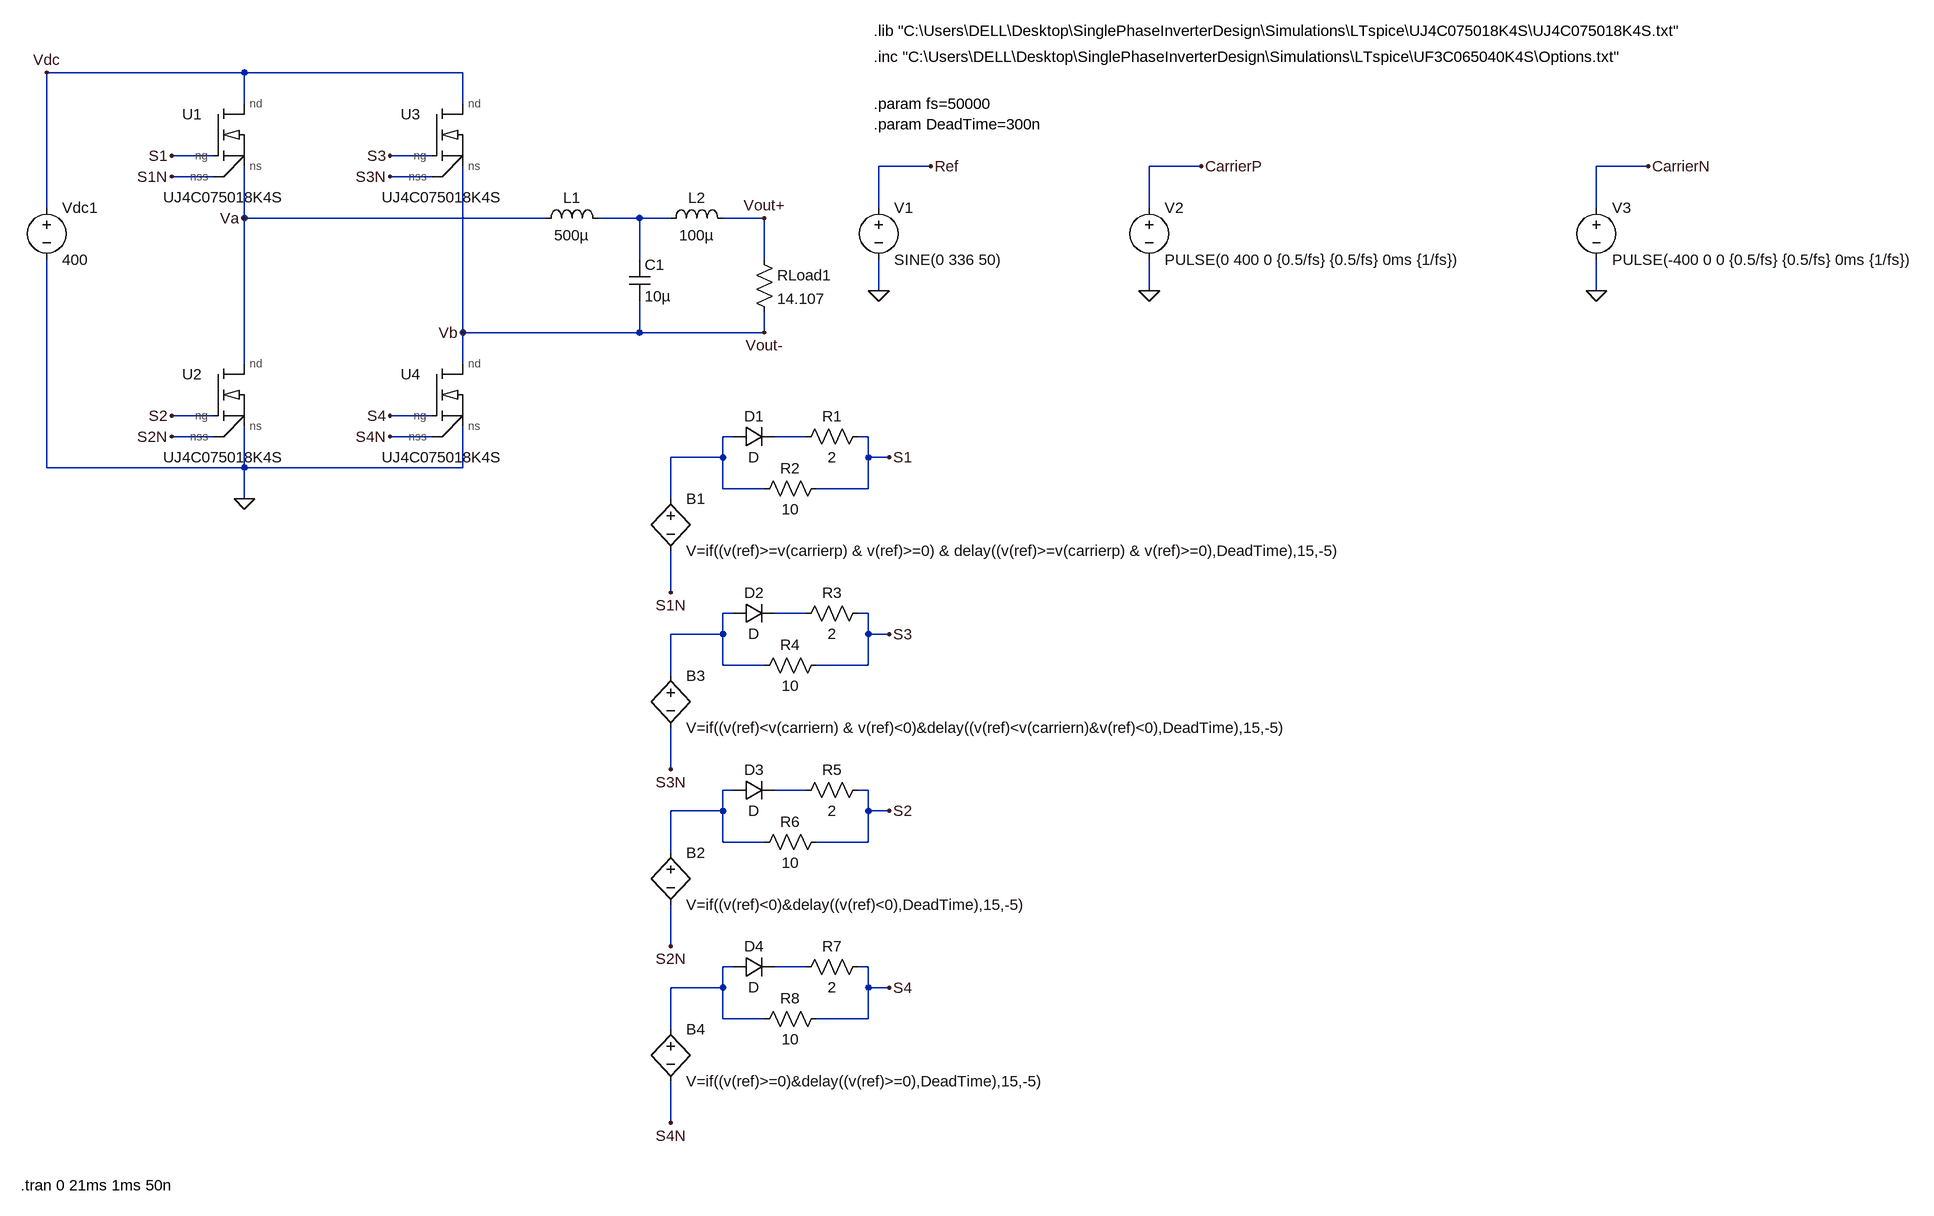
[diagram p0: schematic ModifiedUnipolar_UJ4C075018K4S_DeadTimeLow.asc]
ModifiedUnipolar_UJ4C075018K4S_DeadTimeLow.asc, the LTspice schematic file:
Version 4
SHEET 1 1584 1104
WIRE -992 -624 -1296 -624
WIRE -656 -624 -992 -624
WIRE -992 -576 -992 -624
WIRE -656 -576 -656 -624
WIRE -1040 -496 -1104 -496
WIRE -704 -496 -768 -496
WIRE 64 -480 -16 -480
WIRE 480 -480 400 -480
WIRE 1168 -480 1088 -480
WIRE -1040 -464 -1104 -464
WIRE -704 -464 -768 -464
WIRE -1296 -416 -1296 -624
WIRE -16 -416 -16 -480
WIRE 400 -416 400 -480
WIRE 1088 -416 1088 -480
WIRE -992 -400 -992 -480
WIRE -528 -400 -992 -400
WIRE -384 -400 -448 -400
WIRE -336 -400 -384 -400
WIRE -192 -400 -256 -400
WIRE -384 -336 -384 -400
WIRE -192 -336 -192 -400
WIRE -16 -288 -16 -336
WIRE 400 -288 400 -336
WIRE 1088 -288 1088 -336
WIRE -656 -224 -656 -480
WIRE -384 -224 -384 -272
WIRE -384 -224 -656 -224
WIRE -192 -224 -192 -256
WIRE -192 -224 -384 -224
WIRE -992 -176 -992 -400
WIRE -656 -176 -656 -224
WIRE -1040 -96 -1104 -96
WIRE -704 -96 -768 -96
WIRE -1040 -64 -1104 -64
WIRE -704 -64 -768 -64
WIRE -240 -64 -256 -64
WIRE -128 -64 -176 -64
WIRE -32 -64 -48 -64
WIRE -256 -32 -256 -64
WIRE -256 -32 -336 -32
WIRE -32 -32 -32 -64
WIRE 0 -32 -32 -32
WIRE -1296 -16 -1296 -336
WIRE -992 -16 -992 -80
WIRE -992 -16 -1296 -16
WIRE -656 -16 -656 -80
WIRE -656 -16 -992 -16
WIRE -256 16 -256 -32
WIRE -192 16 -256 16
WIRE -32 16 -32 -32
WIRE -32 16 -112 16
WIRE -992 32 -992 -16
WIRE -336 32 -336 -32
WIRE -336 176 -336 112
WIRE -240 208 -256 208
WIRE -128 208 -176 208
WIRE -32 208 -48 208
WIRE -256 240 -256 208
WIRE -256 240 -336 240
WIRE -32 240 -32 208
WIRE 0 240 -32 240
WIRE -256 288 -256 240
WIRE -192 288 -256 288
WIRE -32 288 -32 240
WIRE -32 288 -112 288
WIRE -336 304 -336 240
WIRE -336 448 -336 384
WIRE -240 480 -256 480
WIRE -128 480 -176 480
WIRE -32 480 -48 480
WIRE -256 512 -256 480
WIRE -256 512 -336 512
WIRE -32 512 -32 480
WIRE 0 512 -32 512
WIRE -256 560 -256 512
WIRE -192 560 -256 560
WIRE -32 560 -32 512
WIRE -32 560 -112 560
WIRE -336 576 -336 512
WIRE -336 720 -336 656
WIRE -240 752 -256 752
WIRE -128 752 -176 752
WIRE -32 752 -48 752
WIRE -256 784 -256 752
WIRE -256 784 -336 784
WIRE -32 784 -32 752
WIRE 0 784 -32 784
WIRE -256 832 -256 784
WIRE -192 832 -256 832
WIRE -32 832 -32 784
WIRE -32 832 -112 832
WIRE -336 848 -336 784
WIRE -336 992 -336 928
FLAG -16 -288 0
FLAG 64 -480 Ref
FLAG 400 -288 0
FLAG 480 -480 CarrierP
FLAG -992 32 0
FLAG -192 -400 Vout+
FLAG 1088 -288 0
FLAG 1168 -480 CarrierN
FLAG -192 -224 Vout-
FLAG 0 -32 S1
FLAG 0 240 S3
FLAG 0 512 S2
FLAG 0 784 S4
FLAG -336 176 S1N
FLAG -336 448 S3N
FLAG -336 720 S2N
FLAG -336 992 S4N
FLAG -1104 -496 S1
FLAG -1104 -96 S2
FLAG -1104 -464 S1N
FLAG -1104 -64 S2N
FLAG -768 -496 S3
FLAG -768 -464 S3N
FLAG -768 -96 S4
FLAG -768 -64 S4N
FLAG -1296 -624 Vdc
FLAG -992 -400 Va
FLAG -656 -224 Vb
SYMBOL voltage -16 -432 R0
WINDOW 123 0 0 Left 0
WINDOW 39 0 0 Left 0
SYMATTR InstName V1
SYMATTR Value SINE(0 336 50)
SYMBOL voltage 400 -432 R0
WINDOW 123 0 0 Left 0
WINDOW 39 0 0 Left 0
SYMATTR InstName V2
SYMATTR Value PULSE(0 400 0 {0.5/fs} {0.5/fs} 0ms {1/fs})
SYMBOL bv -336 16 R0
SYMATTR InstName B1
SYMATTR Value V=if((v(ref)>=v(carrierp) & v(ref)>=0) & delay((v(ref)>=v(carrierp) & v(ref)>=0),DeadTime),15,-5)
SYMBOL bv -336 560 R0
SYMATTR InstName B2
SYMATTR Value V=if((v(ref)<0)&delay((v(ref)<0),DeadTime),15,-5)
SYMBOL ind -544 -384 R270
WINDOW 0 32 56 VTop 2
WINDOW 3 5 56 VBottom 2
SYMATTR InstName L1
SYMATTR Value 500µ
SYMATTR SpiceLine Rser=30m
SYMBOL res -208 -352 R0
SYMATTR InstName RLoad1
SYMATTR Value 14.107
SYMBOL voltage -1296 -432 R0
WINDOW 123 0 0 Left 0
WINDOW 39 0 0 Left 0
SYMATTR InstName Vdc1
SYMATTR Value 400
SYMBOL cap -400 -336 R0
SYMATTR InstName C1
SYMATTR Value 10µ
SYMATTR SpiceLine Rser=0.1m
SYMBOL bv -336 288 R0
SYMATTR InstName B3
SYMATTR Value V=if((v(ref)<v(carriern) & v(ref)<0)&delay((v(ref)<v(carriern)&v(ref)<0),DeadTime),15,-5)
SYMBOL bv -336 832 R0
SYMATTR InstName B4
SYMATTR Value V=if((v(ref)>=0)&delay((v(ref)>=0),DeadTime),15,-5)
SYMBOL voltage 1088 -432 R0
WINDOW 123 0 0 Left 0
WINDOW 39 0 0 Left 0
SYMATTR InstName V3
SYMATTR Value PULSE(-400 0 0 {0.5/fs} {0.5/fs} 0ms {1/fs})
SYMBOL res -32 -80 R90
WINDOW 0 0 56 VBottom 2
WINDOW 3 32 56 VTop 2
SYMATTR InstName R1
SYMATTR Value 2
SYMBOL diode -240 -48 R270
WINDOW 0 32 32 VTop 2
WINDOW 3 0 32 VBottom 2
SYMATTR InstName D1
SYMBOL res -96 0 R90
WINDOW 0 0 56 VBottom 2
WINDOW 3 32 56 VTop 2
SYMATTR InstName R2
SYMATTR Value 10
SYMBOL res -32 192 R90
WINDOW 0 0 56 VBottom 2
WINDOW 3 32 56 VTop 2
SYMATTR InstName R3
SYMATTR Value 2
SYMBOL diode -240 224 R270
WINDOW 0 32 32 VTop 2
WINDOW 3 0 32 VBottom 2
SYMATTR InstName D2
SYMBOL res -96 272 R90
WINDOW 0 0 56 VBottom 2
WINDOW 3 32 56 VTop 2
SYMATTR InstName R4
SYMATTR Value 10
SYMBOL res -32 464 R90
WINDOW 0 0 56 VBottom 2
WINDOW 3 32 56 VTop 2
SYMATTR InstName R5
SYMATTR Value 2
SYMBOL diode -240 496 R270
WINDOW 0 32 32 VTop 2
WINDOW 3 0 32 VBottom 2
SYMATTR InstName D3
SYMBOL res -96 544 R90
WINDOW 0 0 56 VBottom 2
WINDOW 3 32 56 VTop 2
SYMATTR InstName R6
SYMATTR Value 10
SYMBOL res -32 736 R90
WINDOW 0 0 56 VBottom 2
WINDOW 3 32 56 VTop 2
SYMATTR InstName R7
SYMATTR Value 2
SYMBOL diode -240 768 R270
WINDOW 0 32 32 VTop 2
WINDOW 3 0 32 VBottom 2
SYMATTR InstName D4
SYMBOL res -96 816 R90
WINDOW 0 0 56 VBottom 2
WINDOW 3 32 56 VTop 2
SYMATTR InstName R8
SYMATTR Value 10
SYMBOL UF3C065040K4S -1024 -528 R0
SYMATTR InstName U1
SYMATTR Value UJ4C075018K4S
SYMBOL UF3C065040K4S -1024 -128 R0
SYMATTR InstName U2
SYMATTR Value UJ4C075018K4S
SYMBOL UF3C065040K4S -688 -528 R0
SYMATTR InstName U3
SYMATTR Value UJ4C075018K4S
SYMBOL UF3C065040K4S -688 -128 R0
SYMATTR InstName U4
SYMATTR Value UJ4C075018K4S
SYMBOL ind -352 -384 R270
WINDOW 0 32 56 VTop 2
WINDOW 3 5 56 VBottom 2
SYMATTR InstName L2
SYMATTR Value 100µ
TEXT -24 -648 Left 2 !.inc "C:\\Users\\DELL\\Desktop\\SinglePhaseInverterDesign\\Simulations\\LTspice\\UF3C065040K4S\\Options.txt"
TEXT -24 -688 Left 2 !.lib "C:\\Users\\DELL\\Desktop\\SinglePhaseInverterDesign\\Simulations\\LTspice\\UJ4C075018K4S\\UJ4C075018K4S.txt"
TEXT -1336 1088 Left 2 !.tran 0 21ms 1ms 50n
TEXT -24 -576 Left 2 !.param fs=50000\n.param DeadTime=300n

The netlist it stands for:
* ModifiedUnipolar_UJ4C075018K4S_DeadTimeLow.asc
V1 Ref 0 SINE(0 336 50)
V2 CarrierP 0 PULSE(0 400 0 {0.5/fs} {0.5/fs} 0ms {1/fs})
B1 N002 S1N V=if((v(ref)>=v(carrierp) & v(ref)>=0) & delay((v(ref)>=v(carrierp) & v(ref)>=0),DeadTime),15,-5)
B2 N006 S2N V=if((v(ref)<0)&delay((v(ref)<0),DeadTime),15,-5)
L1 Va N001 500µ Rser=30m
RLoad1 Vout+ Vb 14.107
Vdc1 Vdc 0 400
C1 N001 Vb 10µ Rser=0.1m
B3 N004 S3N V=if((v(ref)<v(carriern) & v(ref)<0)&delay((v(ref)<v(carriern)&v(ref)<0),DeadTime),15,-5)
B4 N008 S4N V=if((v(ref)>=0)&delay((v(ref)>=0),DeadTime),15,-5)
V3 CarrierN 0 PULSE(-400 0 0 {0.5/fs} {0.5/fs} 0ms {1/fs})
R1 S1 N003 2
D1 N002 N003 D
R2 S1 N002 10
R3 S3 N005 2
D2 N004 N005 D
R4 S3 N004 10
R5 S2 N007 2
D3 N006 N007 D
R6 S2 N006 10
R7 S4 N009 2
D4 N008 N009 D
R8 S4 N008 10
XU1 Vdc S1 Va S1N UJ4C075018K4S  ; pins nd ng ns nss
XU2 Va S2 0 S2N UJ4C075018K4S  ; pins nd ng ns nss
XU3 Vdc S3 Vb S3N UJ4C075018K4S  ; pins nd ng ns nss
XU4 Vb S4 0 S4N UJ4C075018K4S  ; pins nd ng ns nss
L2 N001 Vout+ 100µ
.model D D
.lib standard.dio
.inc "C:\Users\DELL\Desktop\SinglePhaseInverterDesign\Simulations\LTspice\UF3C065040K4S\Options.txt"
.lib "C:\Users\DELL\Desktop\SinglePhaseInverterDesign\Simulations\LTspice\UJ4C075018K4S\UJ4C075018K4S.txt"
.tran 0 21ms 1ms 50n
.param fs=50000
.param DeadTime=300n
.lib C:\Users\ycay\Desktop\FullBridge_Modulations\Transformless_SP_Inverter\FullBridge_LTspice\UF3C065040K4S\UF3C065040K4S.txt
.backanno
.end